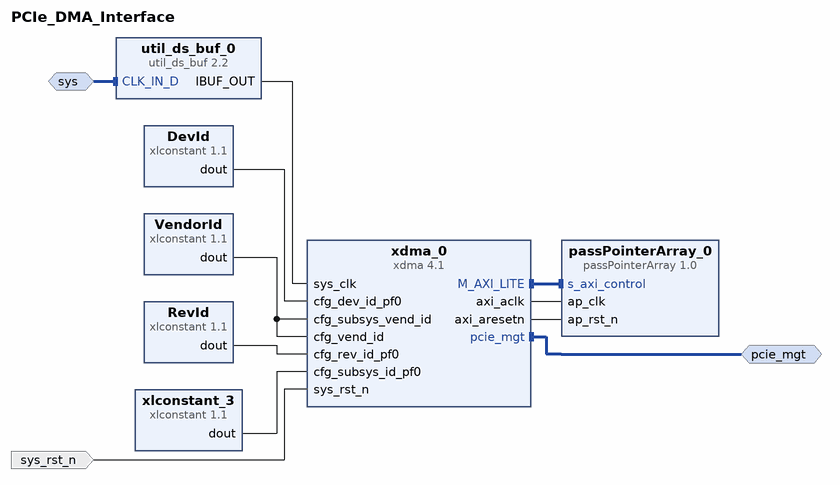
[diagram p0: block diagram of the top level]
# Vivado block design PCIe_DMA_Interface, xc7a50tcsg325-2, Vivado 2021.2
create_bd_design PCIe_DMA_Interface

create_bd_intf_port -mode Master -vlnv xilinx.com:interface:pcie_7x_mgt_rtl:1.0 pcie_mgt
create_bd_intf_port -mode Slave -vlnv xilinx.com:interface:diff_clock_rtl:1.0 sys
create_bd_port -dir I -type rst sys_rst_n

create_bd_cell -type ip -vlnv xilinx.com:ip:xdma:4.1 xdma_0
set_property -dict {CONFIG.axilite_master_en true CONFIG.pcie_id_if true} [get_bd_cells xdma_0]
create_bd_cell -type ip -vlnv xilinx.com:ip:xlconstant:1.1 VendorId
set_property -dict {CONFIG.CONST_WIDTH 16} [get_bd_cells VendorId]
create_bd_cell -type ip -vlnv xilinx.com:ip:xlconstant:1.1 DevId
set_property -dict {CONFIG.CONST_WIDTH 16} [get_bd_cells DevId]
create_bd_cell -type ip -vlnv xilinx.com:ip:xlconstant:1.1 RevId
set_property -dict {CONFIG.CONST_WIDTH 8} [get_bd_cells RevId]
create_bd_cell -type ip -vlnv xilinx.com:ip:xlconstant:1.1 xlconstant_3
set_property -dict {CONFIG.CONST_WIDTH 16} [get_bd_cells xlconstant_3]
create_bd_cell -type ip -vlnv xilinx.com:hls:passPointerArray:1.0 passPointerArray_0
create_bd_cell -type ip -vlnv xilinx.com:ip:util_ds_buf:2.2 util_ds_buf_0

# ---- connections ----

connect_bd_intf_net [get_bd_intf_ports sys] [get_bd_intf_pins util_ds_buf_0/CLK_IN_D]
connect_bd_intf_net [get_bd_intf_pins xdma_0/M_AXI_LITE] [get_bd_intf_pins passPointerArray_0/s_axi_control]
connect_bd_intf_net [get_bd_intf_ports pcie_mgt] [get_bd_intf_pins xdma_0/pcie_mgt]
connect_bd_net [get_bd_pins DevId/dout] [get_bd_pins xdma_0/cfg_dev_id_pf0]
connect_bd_net [get_bd_ports sys_rst_n] [get_bd_pins xdma_0/sys_rst_n]
connect_bd_net [get_bd_pins util_ds_buf_0/IBUF_OUT] [get_bd_pins xdma_0/sys_clk]
connect_bd_net [get_bd_pins xdma_0/axi_aclk] [get_bd_pins passPointerArray_0/ap_clk]
connect_bd_net [get_bd_pins xdma_0/axi_aresetn] [get_bd_pins passPointerArray_0/ap_rst_n]
connect_bd_net -net xlconstant_0_dout [get_bd_pins VendorId/dout] [get_bd_pins xdma_0/cfg_subsys_vend_id] [get_bd_pins xdma_0/cfg_vend_id]
connect_bd_net -net xlconstant_2_dout [get_bd_pins RevId/dout] [get_bd_pins xdma_0/cfg_rev_id_pf0]
connect_bd_net [get_bd_pins xlconstant_3/dout] [get_bd_pins xdma_0/cfg_subsys_id_pf0]

validate_bd_design
save_bd_design
